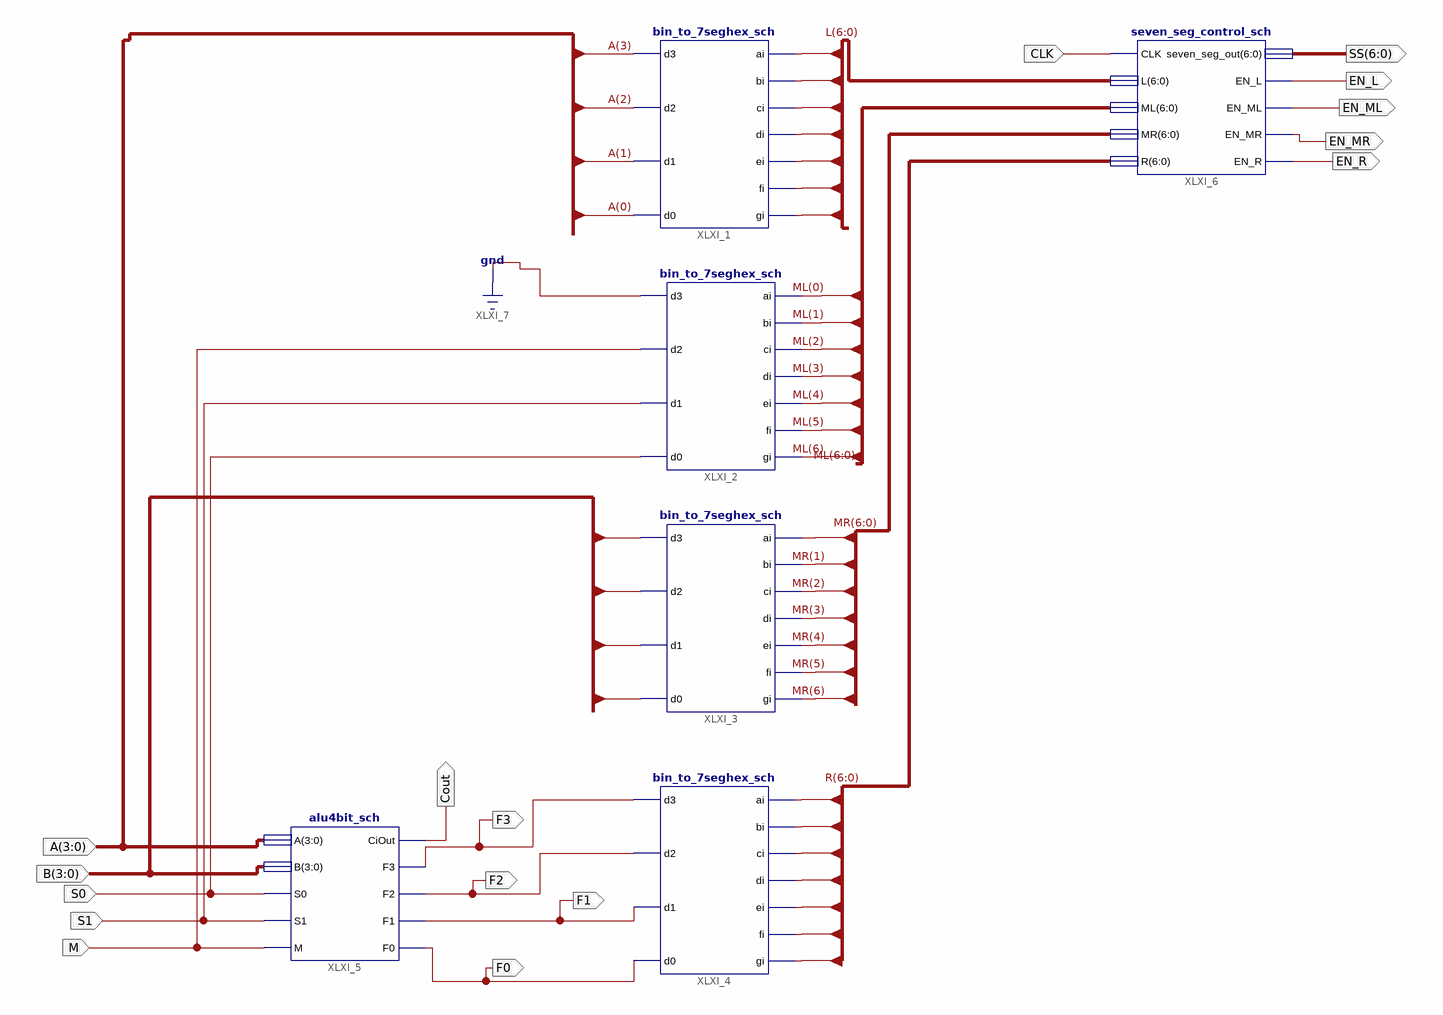
[diagram p0: schematic sheet 1]
// Xilinx ISE schematic alu4bit_board_sch.sch (spartan3e) as structural Verilog: 6 symbols, 16 ports
module alu4bit_board_sch (
  input  [3:0] A,
  input  [3:0] B,
  input  S1,
  input  M,
  input  S0,
  input  CLK,
  output F0,
  output F2,
  output F3,
  output Cout,
  output F1,
  output [6:0] SS,
  output EN_L,
  output EN_ML,
  output EN_MR,
  output EN_R
);

  wire [6:0] L, ML, MR, R;

  alu4bit_sch XLXI_5 (.A(A), .B(B), .S0(S0), .S1(S1), .M(M), .CiOut(Cout), .F3(F3), .F2(F2), .F1(F1), .F0(F0));
  seven_seg_control_sch XLXI_6 (
    .CLK(CLK), .L(L), .ML(ML), .MR(MR), .R(R), .EN_MR(EN_MR), .EN_L(EN_L), .EN_ML(EN_ML), .EN_R(EN_R),
    .seven_seg_out(SS));
  bin_to_7seghex_sch XLXI_1 (
    .d3(A[3]), .d2(A[2]), .d1(A[1]), .d0(A[0]), .ai(L[0]), .bi(L[1]), .ci(L[2]), .di(L[3]), .ei(L[4]),
    .fi(L[5]), .gi(L[6]));
  bin_to_7seghex_sch XLXI_2 (
    .d3(1'b0), .d2(M), .d1(S1), .d0(S0), .ai(ML[0]), .bi(ML[1]), .ci(ML[2]), .di(ML[3]), .ei(ML[4]),
    .fi(ML[5]), .gi(ML[6]));
  bin_to_7seghex_sch XLXI_3 (
    .d3(B[3]), .d2(B[2]), .d1(B[1]), .d0(B[0]), .ai(MR[0]), .bi(MR[1]), .ci(MR[2]), .di(MR[3]), .ei(MR[4]),
    .fi(MR[5]), .gi(MR[6]));
  bin_to_7seghex_sch XLXI_4 (
    .d3(F3), .d2(F2), .d1(F1), .d0(F0), .ai(R[0]), .bi(R[1]), .ci(R[2]), .di(R[3]), .ei(R[4]), .fi(R[5]),
    .gi(R[6]));
endmodule
